# Altium schematic sheet Output.SchDoc
size A4; SheetNumber: 3; SheetTotal: 4
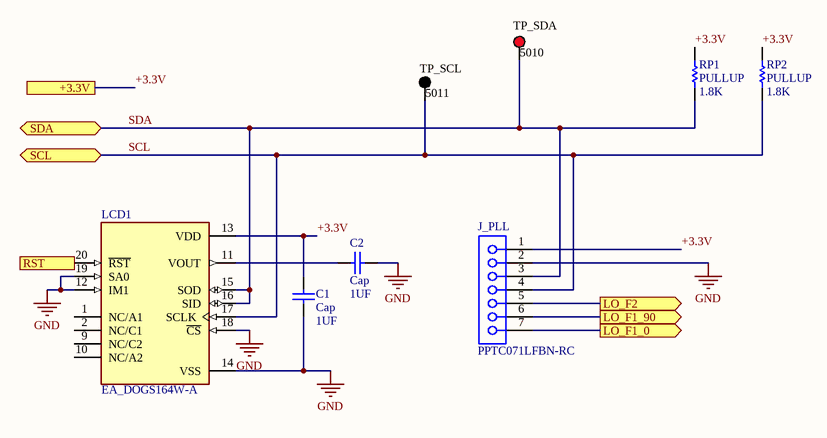
[diagram p0: Output.SchDoc]

## Parts
C1  Cap  value 1UF  [RADIAL-0.1]
C2  Cap  value 1UF  [RADIAL-0.1]
J_PLL  PPTC071LFBN-RC  [SMTC-SSQ-107-01-X-S]
LCD1  EA_DOGS164W-A  [LCD_EA_DOGS164W-A]
RP1  PULLUP  value 1.8K  [AXIAL-0.1-RES]
RP2  PULLUP  value 1.8K  [AXIAL-0.1-RES]
TP_SCL  5011  [KSTN-5011_V]
TP_SDA  5010  [KSTN-5010_V]

## Ports
+3.3V, LO_F1_0 (out), LO_F1_90 (out), LO_F2 (out), RST (in), SCL (bidir), SDA (bidir)

## Nets
GND: C1.1 C2.1 J_PLL.2 LCD1.12(IM1) LCD1.14(VSS) LCD1.18(~{CS}) LCD1.19(SA0)
+3.3V: C1.2 J_PLL.1 LCD1.13(VDD) RP1.2 RP2.2 ; port +3.3V
LO_F1_0: J_PLL.7 ; port LO_F1_0
LO_F1_90: J_PLL.6 ; port LO_F1_90
LO_F2: J_PLL.5 ; port LO_F2
RST: LCD1.20(~{RST}) ; port RST
SCL: J_PLL.4 LCD1.17(SCLK) RP2.1 TP_SCL.1 ; port SCL
SDA: J_PLL.3 LCD1.15(SOD) LCD1.16(SID) RP1.1 TP_SDA.1 ; port SDA
NetC2_2: C2.2 LCD1.11(VOUT)

Not connected (* = marked no-connect by the designer): LCD1 1(NC/A1) 2(NC/C1) 9(NC/C2) 10(NC/A2)

## Library data of the parts
C1 C2 = CAP ALUM 1UF 20% 100V RADIAL: Capacitor; Manufacturer Part Number: ESE105M100AC3EA; Designator: C?; Voltage Rating: 100V; Published: 8-Jun-2000; LatestRevisionDate: 17-Jul-2002; LatestRevisionNote: Re-released for DXP Platform.; Publisher: Altium Limited
J_PLL = CMP-1023-00284-1: SQ Post Socket, Through-hole, Vertical, -55 to 125 degC, 2.54 mm Pitch, 7-Pin, Female, RoHS; PartNumber: SSQ-107-01-G-S; Manufacturer: Samtec; Pitch: 2.54 mm; PackageDescription: Assembly, Socket Strip .025[0.64] SQ Tail; PackageReference: SSQ-107-01-X-S; ComponentLink2URL: http://www.samtec.com/documents/webfiles/pdf/SSQ_TH.PDF; ComponentLink1URL: http://www.samtec.com; ComponentLink3Description: Package Specification; PackageVersion: BD, 6/1987; RoHS: True; DatasheetVersion: F-214; Mounting Technology: Through-hole; ComponentLink3URL: http://www.samtec.com/documents/webfiles/cpdf/SSQ-1XX-XX-XXX-X-XX-XXX-XX-X-MKT.pdf; ComponentLink1Description: Manufacturer URL; Temperature Range: -55 to 125 degC; Orientation: Vertical; ComponentLink2Description: Datasheet
LCD1 = EA_DOGS164W-A: Character LCD Display Module Transflective 5 x 32 Dots FSTN - Film Super-Twisted Nematic Without Backlight IÂ²C, SPI 40.00mm x 33.00mm x 2.60mm; MF: Display Visions; MP: EA DOGS164W-A; Value: *; Check_prices: https://www.snapeda.com/parts/EA%20DOGS164W-A/Focus+Display+Solutions/view-part/?ref=eda; Price: None; SnapEDA_Link: https://www.snapeda.com/parts/EA%20DOGS164W-A/Focus+Display+Solutions/view-part/?ref=snap; Purchase-URL: https://pricing.snapeda.com/search/part/EA DOGS164W-A/?ref=eda; Package: None; Availability: In Stock
RP1 RP2 = RES 1.8K OHM 5% 1/4W AXIAL: Resistor; Manufacturer Part Number: CFR-25JB-52-1K8; Designator: R?; Power Rating: 1/4W; Tolerance: 0.05; Published: 8-Jun-2000; LatestRevisionDate: 17-Jul-2002; LatestRevisionNote: Re-released for DXP Platform.; Publisher: Altium Limited
TP_SCL = CMP-1672-00003-4: Test Point, Black, Through Hole, RoHS, Bulk; Manufacturer: Keystone; ComponentLink2URL: http://www.keyelco.com/product-pdf.cfm?p=1320; Colour: Black; Pins: 1; REACH SVHC: No SVHC; ComponentLink1URL: http://www.keyelco.com/; PackageReference: 5011; Contact Plating: Silver; Package Quantity: 100; Packaging: Bulk; RoHSCompliant: true; Height: 8.12 mm; PackageDescription: 1-Pin Through Hole Device, Dia 3.17 mm; Mount: Through Hole; Mounting Technology: Through Hole; DatasheetVersion: Rev. F, 12/2013; ComponentLink1Description: Manufacturer URL; Contact Material: Bronze; ComponentLink2Description: Datasheet
TP_SDA = CMP-1672-00002-4: Test Point, Red, Through Hole, RoHS, Bulk; Manufacturer: Keystone; Contact Material: Bronze; Mounting Technology: Through Hole; RoHSCompliant: true; Pins: 1; Package Quantity: 100; ComponentLink2Description: Datasheet; Height: 8.12 mm; ComponentLink1URL: http://www.keyelco.com/; DatasheetVersion: Rev. F, 12/2013; Mount: Through Hole; PackageReference: 5010; Contact Plating: Silver; Packaging: Bulk; Colour: Red; REACH SVHC: No SVHC; PackageDescription: 1-Pin Through Hole Device, Dia 3.17 mm; ComponentLink2URL: http://www.keyelco.com/product-pdf.cfm?p=1319; ComponentLink1Description: Manufacturer URL